# Altium schematic sheet Макет генератора сигналов.SchDoc
size A4
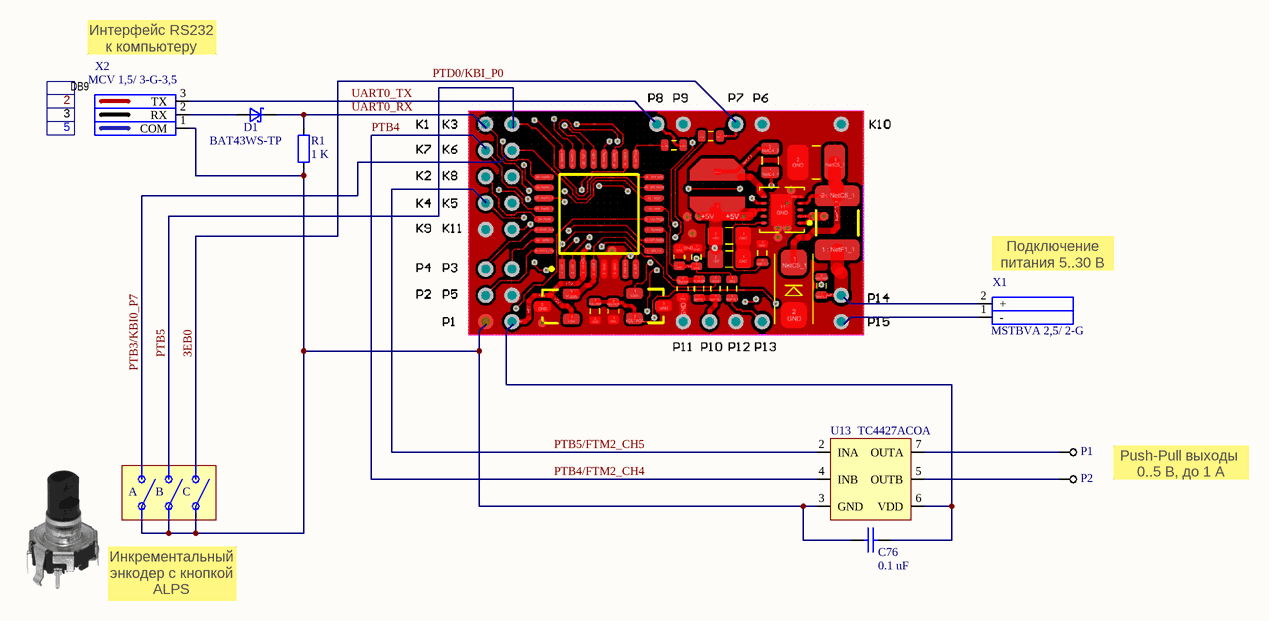
[diagram p0: Макет генератора сигналов.SchDoc]

## Parts
C76  value 0.1 uF  [1608[0603]]  (hidden comment: CVNF100K0603-25)
D1  BAT43WS-TP  [SOD323]
P1  Pin 0.7 mm  [Mount hole 0.7 mm]  (value not drawn)  (net tie, no BOM)
P2  Pin 0.7 mm  [Mount hole 0.7 mm]  (value not drawn)  (net tie, no BOM)
R1  value 1 K  [0603]  (hidden comment: RL0603K001-1)
U13  TC4427ACOA  [SO-8]
X1  MSTBVA 2,5/ 2-G  [CIM020P1]
X2  MCV 1,5/ 3-G-3,5  [mcv1.5-3-g_3.5]

## Nets
PTB4: U13.4(INB)  [also labelled PTB4/FTM2_CH4]
PTB5/FTM2_CH5: U13.2(INA)
UART0_RX: D1.2(C) R1.2
UART0_TX: X2.3(TX)
NetC76_1: C76.1 R1.1 U13.3(GND) X2.1(COM)
NetC76_2: C76.2 U13.6(VDD)
NetD1_1: D1.1(A) X2.2(RX)
NetP1_1: P1.1 U13.7(OUTA)
NetP2_1: P2.1 U13.5(OUTB)

Not connected (* = marked no-connect by the designer): X1 1(-) 2(+)

## Notes on the sheet
- Интерфейс RS232 к компьютеру
- 2
- DB9
- 3
- 5
- (near X1) Подключение питания 5..30 В
- A
- B
- C
- Push-Pull выходы
  0..5 В, до 1 А
- Инкрементальный энкодер с кнопкой
  ALPS  EC12D1564402

## Library data of the parts
C76 = CVNF100K0603-25: 0.1 uF, 25V, 10% , X7R,  0603 SMD MLC Capacitor; Manufacturer: SAMSUNG; PartNum: CL10B104KA8NNND; Tolerance: 10%; Distributor: Future; Price: 0.0026 Euro; Voltage: 25 V; PartName: CL10B104KA8NNND
D1 = BAT43WS-TP: Schottky 30V 200 mA SOD323; Manufacturer: Micro Commercial Co.; PartNum: BAT43WSTPMSCT-ND; Price: 0.16$; Distributor: DigiKey
R1 = RL0603K001-1: 1 K, 1%, 0603, SMD Resistor, Taped; Manufacturer: Vishay; Voltage: 75 V; Distributor: Schukat; Price: 0.002 Euro; Tolerance: 1%; PartNum: RL0603K001-1
U13 = TC4427ACOA: MOSFET drv 1.5A dual, 4.5-18 V,   8SOIC, 0-70 C; Manufacturer: Microchip Technology; PartNum: TC4427ACOA-ND; Distributor: Digi-Key; Price: 0.84$; PartName: TC4427ACOA
X1 = 796636-2: TERM BLOCK HEADER 2POS 5.0MM; Manufacturer: Phoenix Contact; PartNum: 1755516; Distributor: Phoenix Contact; Price: 0.204 Euro; PartName: MSTBVA 2,5/ 2-G
X2 = MCV1.5/3-G-3.5: Header, 8 A, 160 V, 3.5 mm pitch, 3 pos; Manufacturer: Phoenix Contact; PartNum: 1843619; Distributor: Phoenix Contact; Price: 0.32 Euro; PartName: MCV 1,5/ 3-G-3,5
P1 P2 = Pin 0.7 mm: PartName: Pin 0.7 mm